# EAGLE schematic ampli_auriculares (EAGLE 7.2.0)

## Sheet 1 of 2: CANAL 1
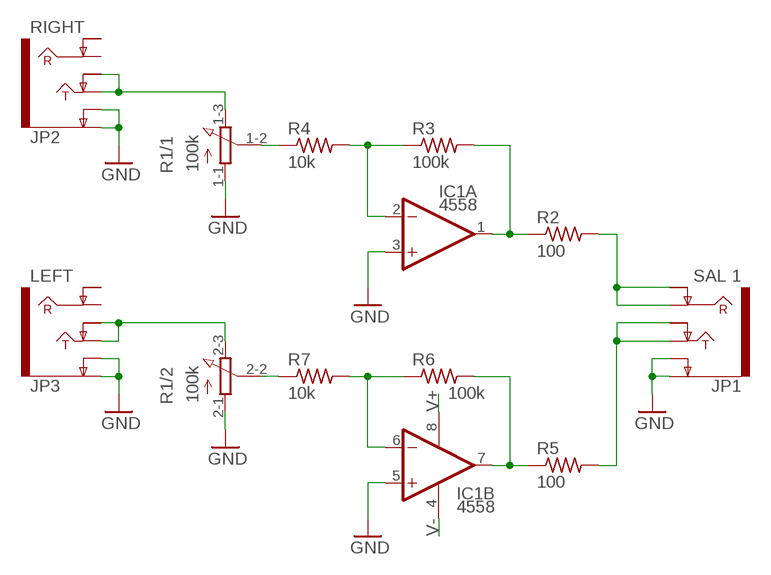
[diagram p0: schematic, sheet 1]

### Parts
IC1  4558  LM1458N  [DIL08]
JP1  SAL 1  AUDIO-JACK4-.25-HORIZ-TRS  [AUDIO-JACK-.25-INCH-HORIZ-PTH]
JP2  RIGHT  AUDIO-JACK4-.25-HORIZ-TRS  [AUDIO-JACK-.25-INCH-HORIZ-PTH]
JP3  LEFT  AUDIO-JACK4-.25-HORIZ-TRS  [AUDIO-JACK-.25-INCH-HORIZ-PTH]
R1  100k  3RP/1610G  [3RP/1610G]
R2  100  R-US_0204/7  [0204/7]
R3  100k  R-US_0204/7  [0204/7]
R4  10k  R-US_0204/7  [0204/7]
R5  100  R-US_0204/7  [0204/7]
R6  100k  R-US_0204/7  [0204/7]
R7  10k  R-US_0204/7  [0204/7]

### Nets
GND: IC1.3(A:+IN) IC1.5(B:+IN) JP1.SLEEVE(EARTH) JP1.SLEEVE-NORM(EARTH-NORM) JP2.SLEEVE(EARTH) JP2.SLEEVE-NORM(EARTH-NORM) JP3.SLEEVE(EARTH) JP3.SLEEVE-NORM(EARTH-NORM) R1.1-1(/1:A) R1.2-1(/2:A) ; also sheet 2
N$1: IC1.1(A:OUT) R2.1 R3.2
N$3: JP2.TIP JP2.TIP-NORM R1.1-3(/1:E)
N$4: IC1.2(A:-IN) R3.1 R4.2
N$5: IC1.7(B:OUT) R5.1 R6.2
N$6: IC1.6(B:-IN) R6.1 R7.2
N$7: R1.1-2(/1:S) R4.1
N$8: R1.2-2(/2:S) R7.1
N$9: JP1.RING JP1.RING-NORM R2.2
N$11: JP1.TIP JP1.TIP-NORM R5.2
N$12: JP3.TIP JP3.TIP-NORM R1.2-3(/2:E)
V+: IC1.8(P:V+) ; also sheet 2
V-: IC1.4(P:V-) ; also sheet 2
Unconnected: JP2.RING JP2.RING-NORM JP3.RING JP3.RING-NORM

## Sheet 2 of 2: POWER
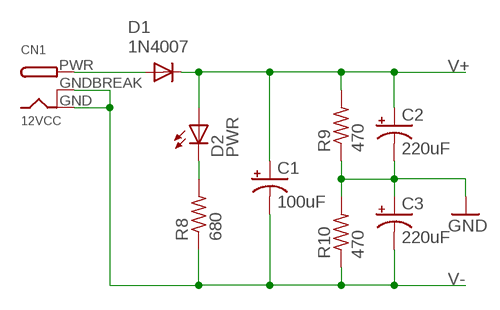
[diagram p1: schematic, sheet 2]

### Parts
C1  100uF  CPOL-USE2.5-6  [E2,5-6]
C2  220uF  CPOL-USE2.5-6  [E2,5-6]
C3  220uF  CPOL-USE2.5-6  [E2,5-6]
CN1  12VCC  DCBARRELPTH  [DCJACK_2MM_PTH]
D1  1N4007  1N4004  [DO41-10]
D2  PWR  LED3MM  [LED3MM]
R8  680  R-US_0204/7  [0204/7]
R9  470  R-US_0207/10  [0207/10]
R10  470  R-US_0207/10  [0207/10]

### Nets
GND: C2.- C3.+ R9.1 R10.2 ; also sheet 1
N$2: CN1.PWR D1.A
N$10: D2.K(C) R8.2
V+: C1.+ C2.+ D1.C D2.A R9.2 ; also sheet 1
V-: C1.- C3.- CN1.GND CN1.GNDBREAK R8.1 R10.1 ; also sheet 1

## Library data of the parts
C1-C3 = adafruit:CPOL-US: POLARIZED CAPACITOR, American symbol
CN1 = adafruit:DCBARREL: 2.0mm DC Barrel Jack DCJACK_2MM_PTH - Through Hole Jack (4UConnector: 05537)
D1 = adafruit:1N4004: DIODE General purpose 1N400x type rectifier (With bigger pads) http://www.ladyada.net/library/pcb/eaglelibrary.html
D2 = led:LED: LED OSRAM: - CHIPLED LG R971, LG N971, LY N971, LG Q971, LY Q971, LO R971, LY R971 LH N974, LH R974 LS Q976, LO Q976, LY Q976 LO Q996 - Hyper CHIPLED LW Q18S LB Q993, LB Q99A, LB R99A - SideLED LS A670, LO A670, LY A670, LG A670, LP A670 LB A673, LV A673, LT A673, LW A673 LH A674 LY A675 LS A676, LA A676, LO A676, LY A676, LW A676 LS A679, LY A679, LG A679 - Hyper Micro SIDELED® LS Y876, LA Y876, LO Y876, LY Y876 LT Y87S - SmartLED LW L88C, LW L88S LB L89C, LB L89S, LG L890 LS L89K, LO L89K, LY L89K LS L896, LA L896, LO L896, LY L896 - TOPLED LS T670, LO T670, LY T670, LG T670, LP T670 LSG T670, LSP T670, LSY T670, LOP T670, LYG T670 LG T671, LOG T671, LSG T671 LB T673, LV T673, LT T673, LW T673 LH T674 LS T676, LA T676, LO T676, LY T676, LB T676, LH T676, LSB T676, LW T676 LB T67C, LV T67C, LT T67C, LS T67K, LO T67K, LY T67K, LW E67C LS E67B, LA E67B, LO E67B, LY E67B, LB E67C, LV E67C, LT E67C LW T67C LS T679, LY T679, LG T679 LS T770, LO T770, LY T770, LG T770, LP T770 LB T773, LV T773, LT T773, LW T773 LH T774 LS E675, LA E675, LY E675, LS T675 LS T776, LA T776, LO T776, LY T776, LB T776 LHGB T686 LT T68C, LB T68C - Hyper Mini TOPLED® LB M676 - Mini TOPLED Santana® LG M470 LS M47K, LO M47K, LY M47K Source: http://www.osram.convergy.de LUXEON: - LUMILED® LXK2-PW12-R00, LXK2-PW12-S00, LXK2-PW14-U00, LXK2-PW14-V00 LXK2-PM12-R00, LXK2-PM12-S00, LXK2-PM14-U00 LXK2-PE12-Q00, LXK2-PE12-R00, LXK2-PE12-S00, LXK2-PE14-T00, LXK2-PE14-U00 LXK2-PB12-K00, LXK2-PB12-L00, LXK2-PB12-M00, LXK2-PB14-N00, LXK2-PB14-P00, LXK2-PB14-Q00 LXK2-PR12-L00, LXK2-PR12-M00, LXK2-PR14-Q00, LXK2-PR14-R00 LXK2-PD12-Q00, LXK2-PD12-R00, LXK2-PD12-S00 LXK2-PH12-R00, LXK2-PH12-S00 LXK2-PL12-P00, LXK2-PL12-Q00, LXK2-PL12-R00 Source: www.luxeon.com KINGBRIGHT: KA-3528ASYC Source: www.kingbright.com
IC1 = linear:*1458: OP AMP
JP1-JP3 = SparkFun-Connectors:AUDIO-JACK4-.25-HORIZ-TRS: 1/4" TRS jack, horizontal Production SKU: COM-11144 Footprint unproven - datasheet and part seem to be slightly different; PROD_ID: COM-11144
R1 = pot:3RP/1610G: 16mm Potentiometer two level Source: http://www.alphapotentiometers.net/html/16mm_pot_2.html
R2-R10 = adafruit:R-US_: RESISTOR, American symbol